# Altium schematic sheet supply.SchDoc
size A4
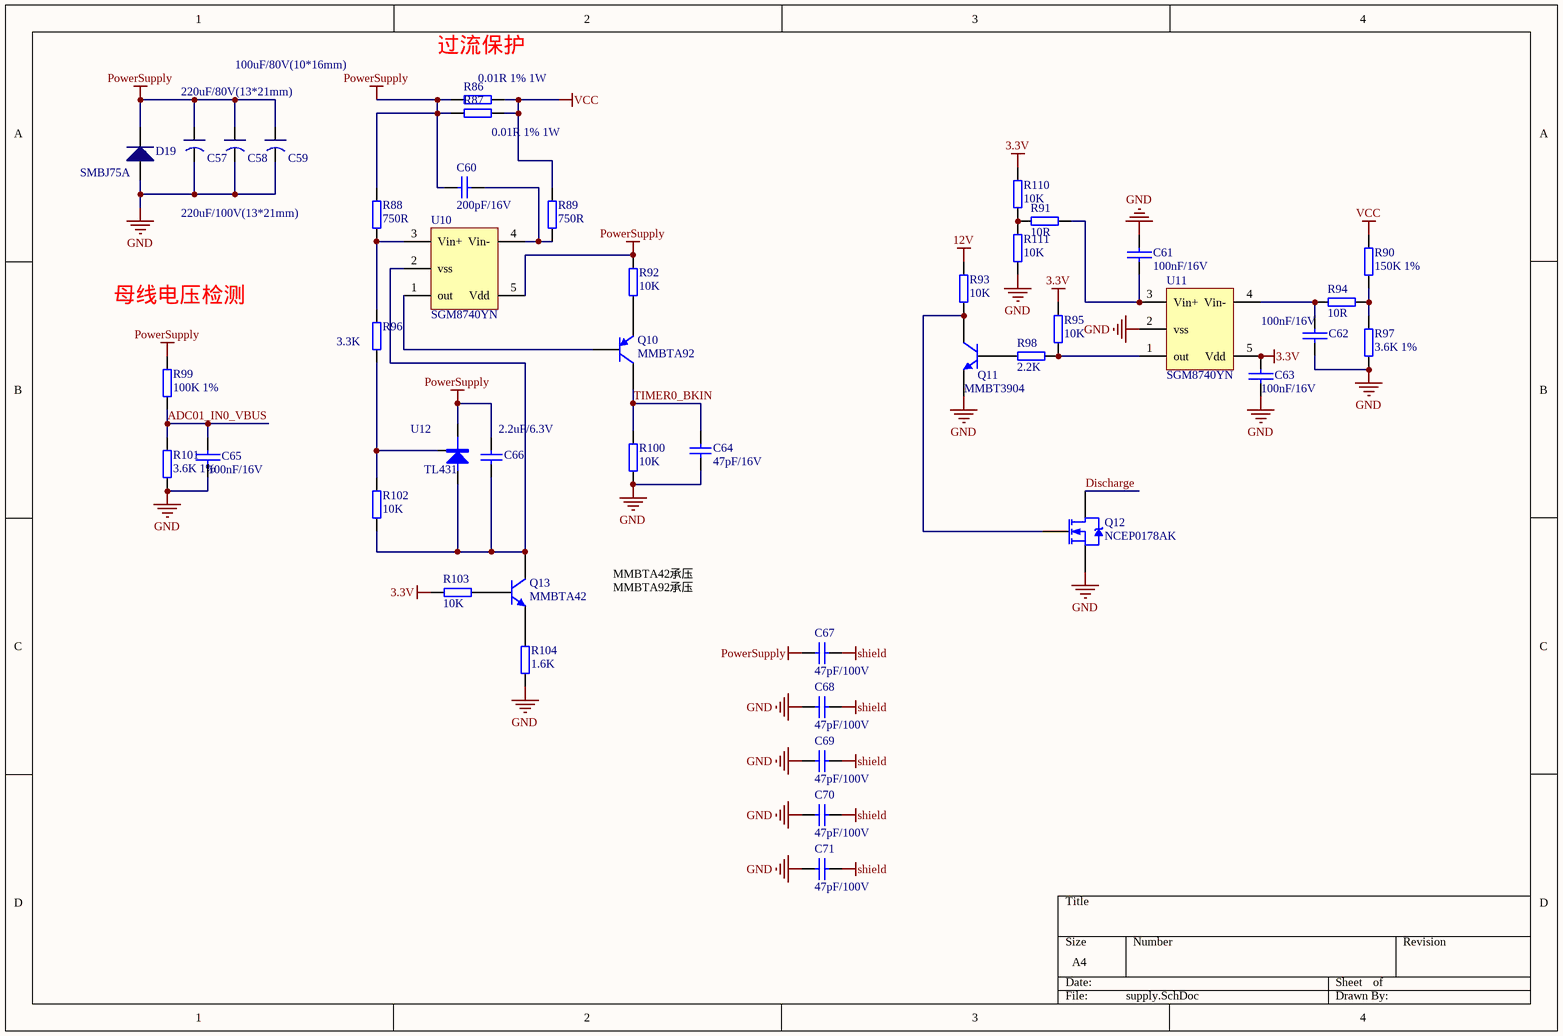
[diagram p0: supply.SchDoc]

## Parts
C57  220uF/80V(13*21mm)  [AL-ELEC 13*21mm]
C58  220uF/100V(13*21mm)  [AL-ELEC 13*21mm]
C59  100uF/80V(10*16mm)  [AL-ELEC 10*16mm]
C60  200pF/16V  [C0402]
C61  100nF/16V  [C0402]
C62  100nF/16V  [C0402]
C63  100nF/16V  [C0402]
C64  47pF/16V  [C0402]
C65  100nF/16V  [C0402]
C66  2.2uF/6.3V  [C0402]
C67  47pF/100V  [C1206]
C68  47pF/100V  [C1206]
C69  47pF/100V  [C1206]
C70  47pF/100V  [C1206]
C71  47pF/100V  [C1206]
D19  SMBJ75A  [DO-214AA SMB]
Q10  MMBTA92  [SOT-23]
Q11  MMBT3904  [SOT-23]
Q12  NCEP0178AK  [D-PAK(TO-252AA)]
Q13  MMBTA42  [SOT-23]
R86  0.01R 1% 1W  [R1210]
R87  0.01R 1% 1W  [R1210]
R88  750R  [R0402]
R89  750R  [R0402]
R90  150K 1%  [R0603]
R91  10R  [R0402]
R92  10K  [R0402]
R93  10K  [R0402]
R94  10R  [R0402]
R95  10K  [R0402]
R96  3.3K  [R0402]
R97  3.6K 1%  [R0603]
R98  2.2K  [R0402]
R99  100K 1%  [R0603]
R100  10K  [R0402]
R101  3.6K 1%  [R0603]
R102  10K  [R0402]
R103  10K  [R0402]
R104  1.6K  [R0402]
R110  10K  [R0402]
R111  10K  [R0402]
U10  SGM8740YN  [SOT-23(5)]
U11  SGM8740YN  [SOT-23(5)]
U12  TL431  [SOT-23]

## Nets
3.3V: C63.1 R95.2 R103.1 R110.2 U11.5(Vdd)
12V: R93.2
GND: C57.2 C58.2 C59.2 C61.2 C62.2 C63.2 C64.2 C65.2 C68.2 C69.2 C70.2 C71.2 D19.1 Q11.2(E) Q12.2(S) R97.1 R100.1 R101.1 R104.1 R111.1 U11.2(vss)
PowerSupply: C57.1 C58.1 C59.1 C60.2 C66.1 C67.2 D19.2 R86.2 R87.2 R88.2 R92.2 R99.2 U10.5(Vdd) U12.1(Cathode)
shield: C67.1 C68.1 C69.1 C70.1 C71.1
VCC: R86.1 R87.1 R89.2 R90.2
ADC01_IN0_VBUS: C65.1 R99.1 R101.2
Discharge: Q12.3(D)
TIMER0_BKIN: C64.1 Q10.3(C) R100.2
NetC60_1: C60.1 R89.1 U10.4(Vin-)
NetC61_1: C61.1 R91.1 U11.3(Vin+)
NetC62_1: C62.1 R94.2 U11.4(Vin-)
NetC66_2: C66.2 Q13.3(C) R102.2 U10.2(vss) U12.3(Anode)
NetQ10_1: Q10.1(B) U10.1(out)
NetQ10_2: Q10.2(E) R92.1
NetQ11_1: Q11.1(B) R98.1
NetQ11_3: Q11.3(C) Q12.1(G) R93.1
NetQ13_1: Q13.1(B) R103.2
NetQ13_2: Q13.2(E) R104.2
NetR88_1: R88.1 R96.1 U10.3(Vin+)
NetR90_1: R90.1 R94.1 R97.2
NetR91_2: R91.2 R110.1 R111.2
NetR95_1: R95.1 R98.2 U11.1(out)
NetR96_2: R96.2 R102.1 U12.2(REF)

## Notes on the sheet
- 过流保护
- 母线电压检测
- MMBTA42承压MMBTA92承压

## Library data of the parts
C57-C59 = Capacitor: 铝电解电容
C60 C64 C66-C71 = cap
C61-C63 C65 = CAP: Capacitor
D19 = Diode
Q10 = PNP
Q11 Q13 = NPN
Q12 = N-channel Enhancement MOS
R86-R104 R110 R111 = Resistance
U10 U11 = LMV7239: 圣邦微电子 丝印 SL5XX
U12 = TL431A: 注意引脚关系：1-C 2-R 3-A